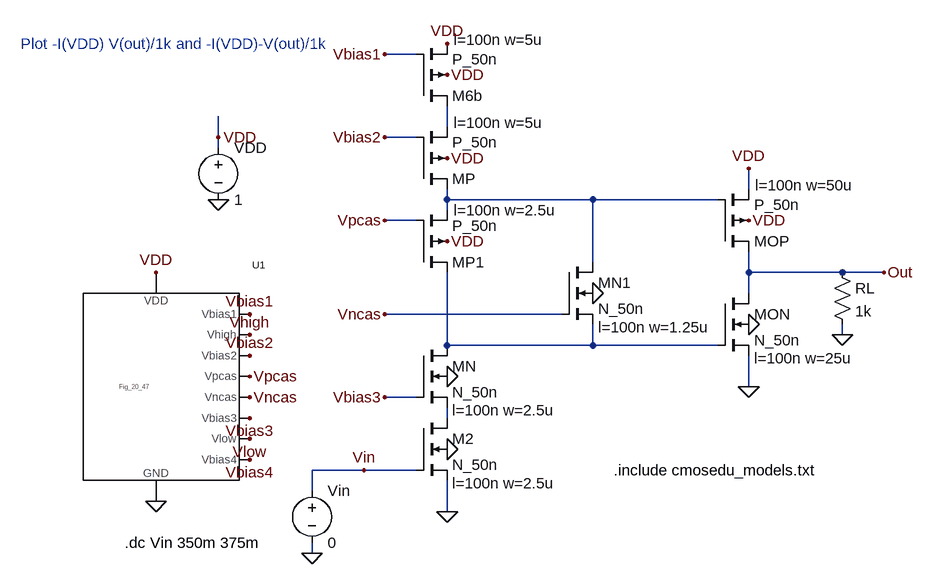
[diagram p0: schematic Fig21_52.asc]
Fig21_52.asc, the LTspice schematic file:
Version 4
SHEET 1 2040 680
WIRE 1200 -576 1152 -576
WIRE 1248 -464 1248 -496
WIRE 896 -448 896 -480
WIRE 1200 -448 1152 -448
WIRE 896 -432 896 -448
WIRE 1712 -368 1712 -400
WIRE 1248 -352 1248 -368
WIRE 1472 -352 1248 -352
WIRE 1664 -352 1472 -352
WIRE 1248 -336 1248 -352
WIRE 1200 -320 1152 -320
WIRE 1472 -256 1472 -352
WIRE 1712 -240 1712 -272
WIRE 1856 -240 1712 -240
WIRE 1920 -240 1856 -240
WIRE 1712 -208 1712 -240
WIRE 1424 -176 1152 -176
WIRE 1856 -144 1856 -160
WIRE 1248 -128 1248 -240
WIRE 1472 -128 1472 -160
WIRE 1472 -128 1248 -128
WIRE 1664 -128 1472 -128
WIRE 1712 -64 1712 -112
WIRE 1200 -48 1152 -48
WIRE 1248 -16 1248 -32
WIRE 1120 64 1040 64
WIRE 1200 64 1120 64
WIRE 1040 96 1040 64
WIRE 1248 128 1248 80
WIRE 1040 192 1040 176
FLAG 896 -352 0
FLAG 896 -448 VDD
FLAG 1248 32 0
FLAG 1248 128 0
FLAG 1248 -80 0
FLAG 1248 -592 VDD
FLAG 1248 -544 VDD
FLAG 1248 -416 VDD
FLAG 1152 -576 Vbias1
FLAG 1152 -448 Vbias2
FLAG 1152 -48 Vbias3
FLAG 800 -240 VDD
FLAG 800 112 0
FLAG 944 -176 Vbias1
FLAG 944 -144 Vhigh
FLAG 944 -112 Vbias2
FLAG 944 -16 Vbias3
FLAG 944 -80 Vpcas
FLAG 944 -48 Vncas
FLAG 944 48 Vbias4
FLAG 944 16 Vlow
FLAG 1248 -288 VDD
FLAG 1472 -208 0
FLAG 1712 -320 VDD
FLAG 1712 -160 0
FLAG 1152 -320 Vpcas
FLAG 1152 -176 Vncas
FLAG 1712 -400 VDD
FLAG 1712 -64 0
FLAG 1920 -240 Out
FLAG 1120 64 Vin
FLAG 1040 192 0
FLAG 1856 -144 0
SYMBOL voltage 896 -448 R0
WINDOW 123 0 0 Left 2
WINDOW 39 0 0 Left 2
SYMATTR InstName VDD
SYMATTR Value 1
SYMBOL nmos4 1200 -16 R0
WINDOW 123 56 100 Left 2
SYMATTR Value2 l=100n w=2.5u
SYMATTR InstName M2
SYMATTR Value N_50n
SYMBOL nmos4 1200 -128 R0
WINDOW 123 56 100 Left 2
SYMATTR Value2 l=100n w=2.5u
SYMATTR InstName MN
SYMATTR Value N_50n
SYMBOL pmos4 1200 -496 M180
WINDOW 123 58 102 Left 2
WINDOW 0 56 16 Left 2
SYMATTR Value2 l=100n w=5u
SYMATTR InstName M6b
SYMATTR Value P_50n
SYMBOL pmos4 1200 -368 M180
WINDOW 123 58 102 Left 2
WINDOW 0 56 16 Left 2
SYMATTR Value2 l=100n w=5u
SYMATTR InstName MP
SYMATTR Value P_50n
SYMBOL Fig_20_47 800 -64 R0
SYMATTR InstName U1
SYMBOL pmos4 1200 -240 M180
WINDOW 123 58 96 Left 2
WINDOW 0 56 16 Left 2
SYMATTR Value2 l=100n w=2.5u
SYMATTR InstName MP1
SYMATTR Value P_50n
SYMBOL nmos4 1424 -256 R0
WINDOW 123 56 100 Left 2
SYMATTR Value2 l=100n w=1.25u
SYMATTR InstName MN1
SYMATTR Value N_50n
SYMBOL pmos4 1664 -272 M180
WINDOW 123 58 102 Left 2
WINDOW 0 56 16 Left 2
SYMATTR Value2 l=100n w=50u
SYMATTR InstName MOP
SYMATTR Value P_50n
SYMBOL nmos4 1664 -208 R0
WINDOW 123 56 100 Left 2
SYMATTR Value2 l=100n w=25u
SYMATTR InstName MON
SYMATTR Value N_50n
SYMBOL voltage 1040 80 R0
SYMATTR InstName Vin
SYMATTR Value 0
SYMBOL res 1840 -256 R0
SYMATTR InstName RL
SYMATTR Value 1k
TEXT 1504 64 Left 2 !.include cmosedu_models.txt
TEXT 592 -592 Left 2 ;Plot -I(VDD) V(out)/1k and -I(VDD)-V(out)/1k
TEXT 752 176 Left 2 !.dc Vin 350m 375m

The netlist it stands for:
* Fig21_52.asc
VDD VDD 0 1
M2 N004 Vin 0 0 N_50n l=100n w=2.5u
MN N003 Vbias3 N004 0 N_50n l=100n w=2.5u
M6b N001 Vbias1 VDD VDD P_50n l=100n w=5u
MP N002 Vbias2 N001 VDD P_50n l=100n w=5u
XU1 Vbias1 Vhigh Vbias2 Vpcas Vncas Vbias3 Vlow Vbias4 VDD 0 Fig_20_47  ; pins Vbias1 Vhigh Vbias2 Vpcas Vncas Vbias3 Vlow Vbias4 VDD GND
MP1 N003 Vpcas N002 VDD P_50n l=100n w=2.5u
MN1 N002 Vncas N003 0 N_50n l=100n w=1.25u
MOP Out N002 VDD VDD P_50n l=100n w=50u
MON Out N003 0 0 N_50n l=100n w=25u
Vin Vin 0 0
RL Out 0 1k
.model NMOS NMOS
.model PMOS PMOS
.lib standard.mos
.include cmosedu_models.txt
* Plot -I(VDD) V(out)/1k and -I(VDD)-V(out)/1k
.dc Vin 350m 375m
.backanno
.end